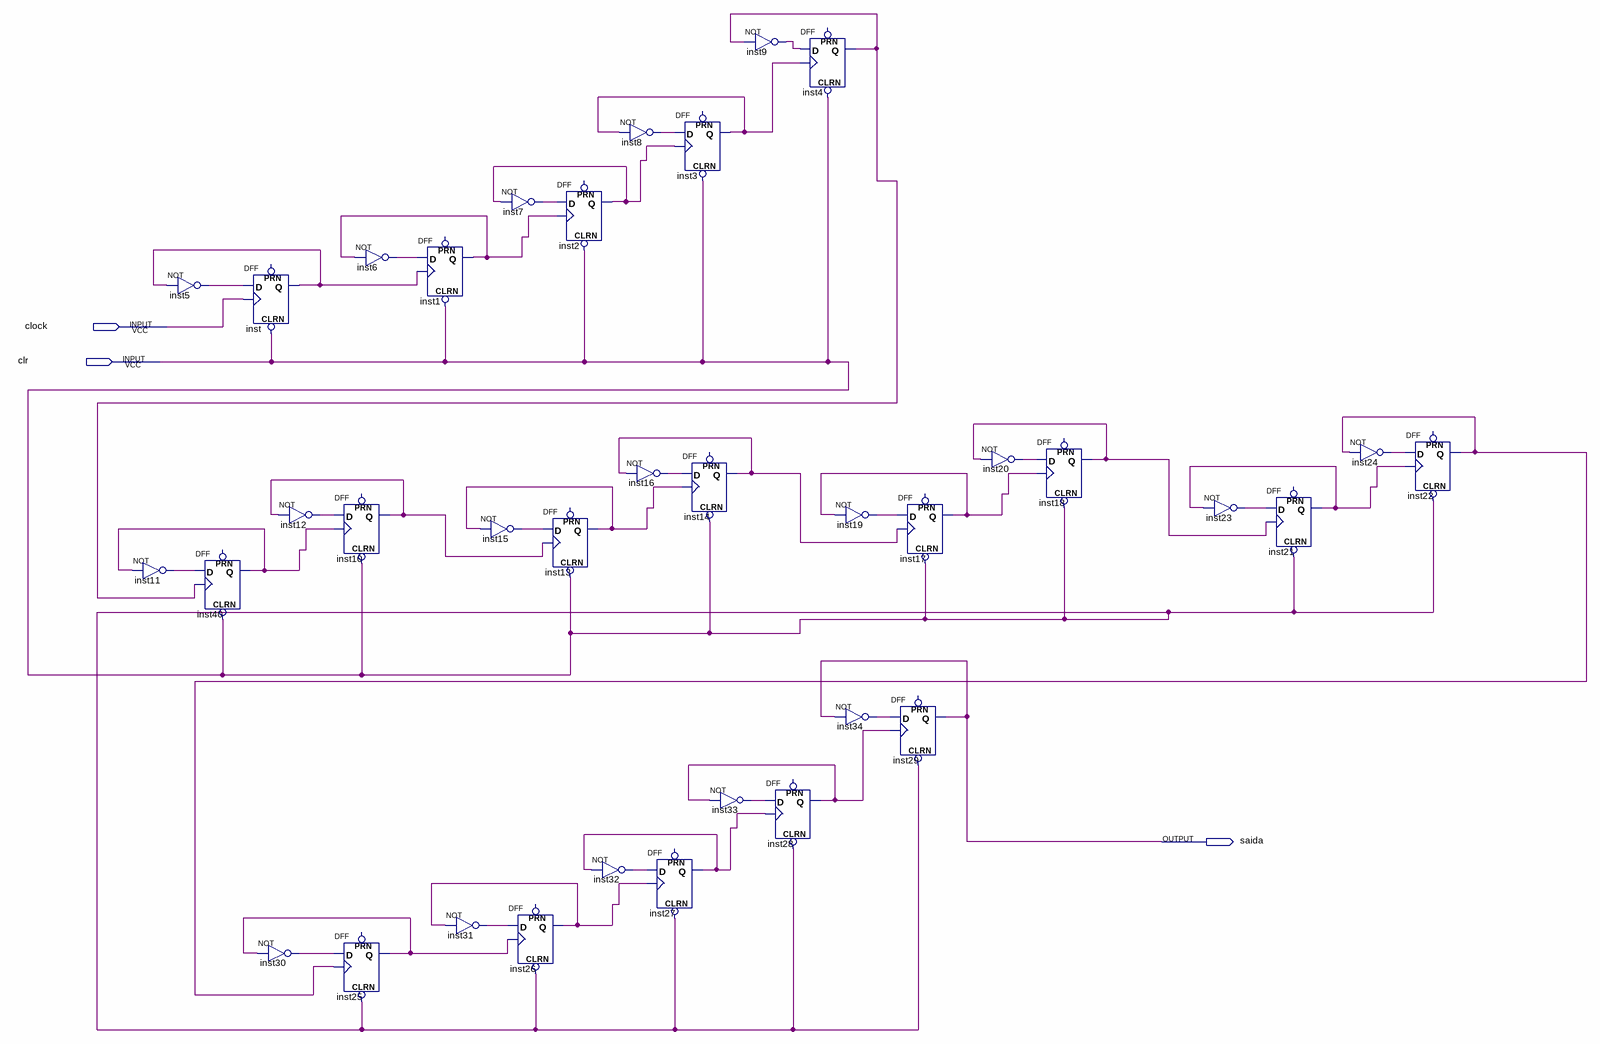
[diagram p0: schematic sheet]
// Quartus schematic lab_05.bdf as structural Verilog: 36 symbols, 3 pins
module lab_05 (
  input  clock,
  input  clr,
  output saida
);

  wire inst1_q, inst2_q, inst3_q, inst4_q, inst5_out, inst6_out, inst7_out, inst8_out, inst9_out, inst10_q,
       inst11_out, inst12_out, inst13_q, inst14_q, inst15_out, inst16_out, inst17_q, inst18_q, inst19_out,
       inst20_out, inst21_q, inst22_q, inst23_out, inst24_out, inst25_q, inst26_q, inst27_q, inst28_q,
       inst30_out, inst31_out, inst32_out, inst33_out, inst34_out, inst40_q, inst_q;

  not inst11 (inst11_out, inst40_q);
  not inst5 (inst5_out, inst_q);
  DFF inst40 (.CLRN(clr), .CLK(inst4_q), .D(inst11_out), .Q(inst40_q));  // open: PRN
  DFF inst (.CLRN(clr), .CLK(clock), .D(inst5_out), .Q(inst_q));  // open: PRN
  not inst12 (inst12_out, inst10_q);
  not inst30 (inst30_out, inst25_q);
  not inst6 (inst6_out, inst1_q);
  DFF inst10 (.CLRN(clr), .CLK(inst40_q), .D(inst12_out), .Q(inst10_q));  // open: PRN
  DFF inst25 (.CLRN(clr), .CLK(inst22_q), .D(inst30_out), .Q(inst25_q));  // open: PRN
  DFF inst1 (.CLRN(clr), .CLK(inst_q), .D(inst6_out), .Q(inst1_q));  // open: PRN
  not inst31 (inst31_out, inst26_q);
  not inst7 (inst7_out, inst2_q);
  not inst15 (inst15_out, inst13_q);
  DFF inst26 (.CLRN(clr), .CLK(inst25_q), .D(inst31_out), .Q(inst26_q));  // open: PRN
  DFF inst2 (.CLRN(clr), .CLK(inst1_q), .D(inst7_out), .Q(inst2_q));  // open: PRN
  DFF inst13 (.CLRN(clr), .CLK(inst10_q), .D(inst15_out), .Q(inst13_q));  // open: PRN
  not inst8 (inst8_out, inst3_q);
  not inst16 (inst16_out, inst14_q);
  not inst32 (inst32_out, inst27_q);
  DFF inst3 (.CLRN(clr), .CLK(inst2_q), .D(inst8_out), .Q(inst3_q));  // open: PRN
  DFF inst14 (.CLRN(clr), .CLK(inst13_q), .D(inst16_out), .Q(inst14_q));  // open: PRN
  DFF inst27 (.CLRN(clr), .CLK(inst26_q), .D(inst32_out), .Q(inst27_q));  // open: PRN
  not inst9 (inst9_out, inst4_q);
  not inst33 (inst33_out, inst28_q);
  DFF inst4 (.CLRN(clr), .CLK(inst3_q), .D(inst9_out), .Q(inst4_q));  // open: PRN
  DFF inst28 (.CLRN(clr), .CLK(inst27_q), .D(inst33_out), .Q(inst28_q));  // open: PRN
  not inst19 (inst19_out, inst17_q);
  not inst34 (inst34_out, saida);
  DFF inst17 (.CLRN(clr), .CLK(inst14_q), .D(inst19_out), .Q(inst17_q));  // open: PRN
  DFF inst29 (.CLRN(clr), .CLK(inst28_q), .D(inst34_out), .Q(saida));  // open: PRN
  not inst20 (inst20_out, inst18_q);
  DFF inst18 (.CLRN(clr), .CLK(inst17_q), .D(inst20_out), .Q(inst18_q));  // open: PRN
  not inst23 (inst23_out, inst21_q);
  DFF inst21 (.CLRN(clr), .CLK(inst18_q), .D(inst23_out), .Q(inst21_q));  // open: PRN
  not inst24 (inst24_out, inst22_q);
  DFF inst22 (.CLRN(clr), .CLK(inst21_q), .D(inst24_out), .Q(inst22_q));  // open: PRN
endmodule
